# Altium schematic sheet stm32h755xih3.SchDoc
size 594 x 420 mm
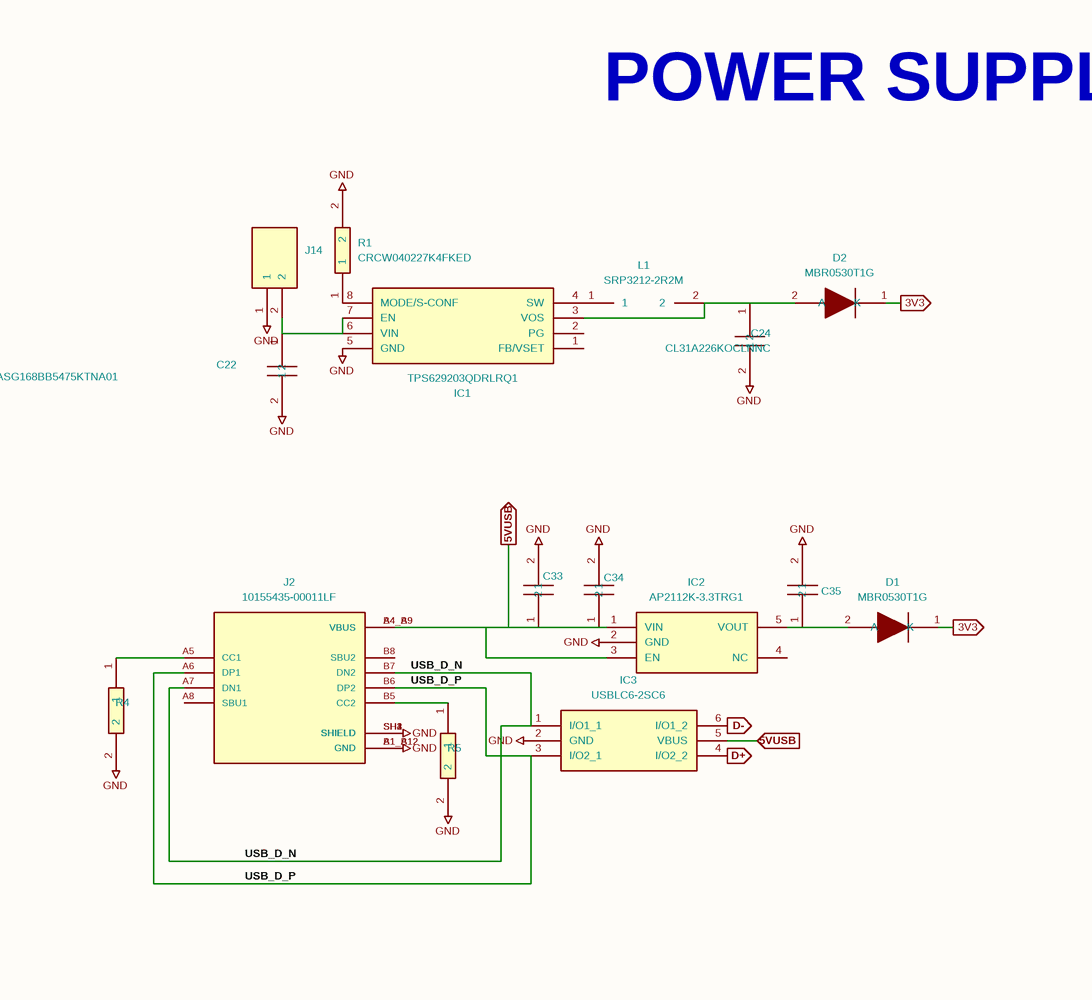
[diagram p0: stm32h755xih3.SchDoc, top left]
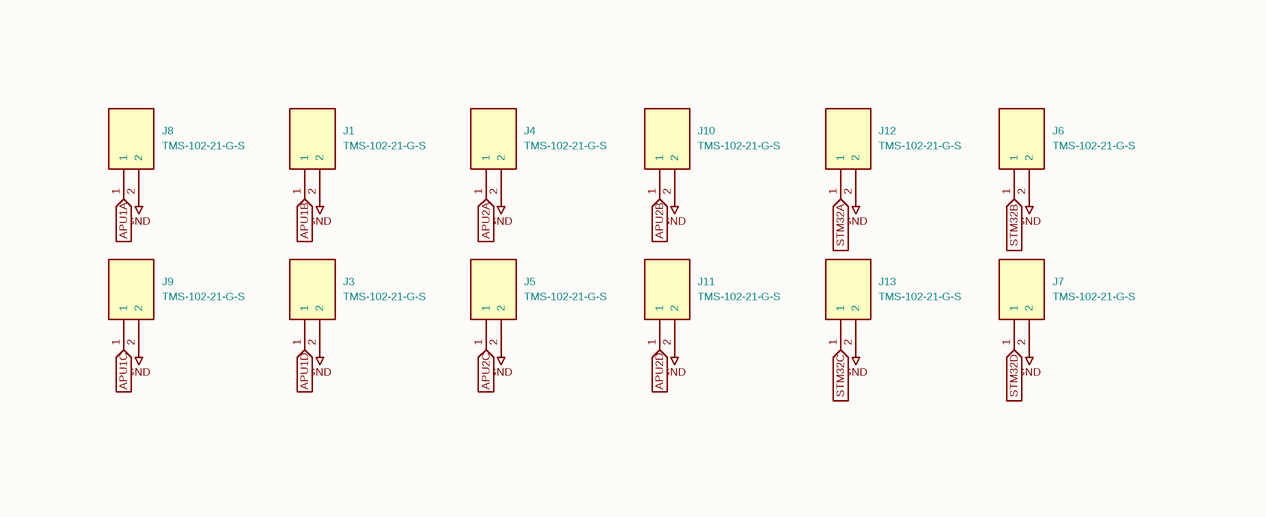
[diagram p1: stm32h755xih3.SchDoc, top right]
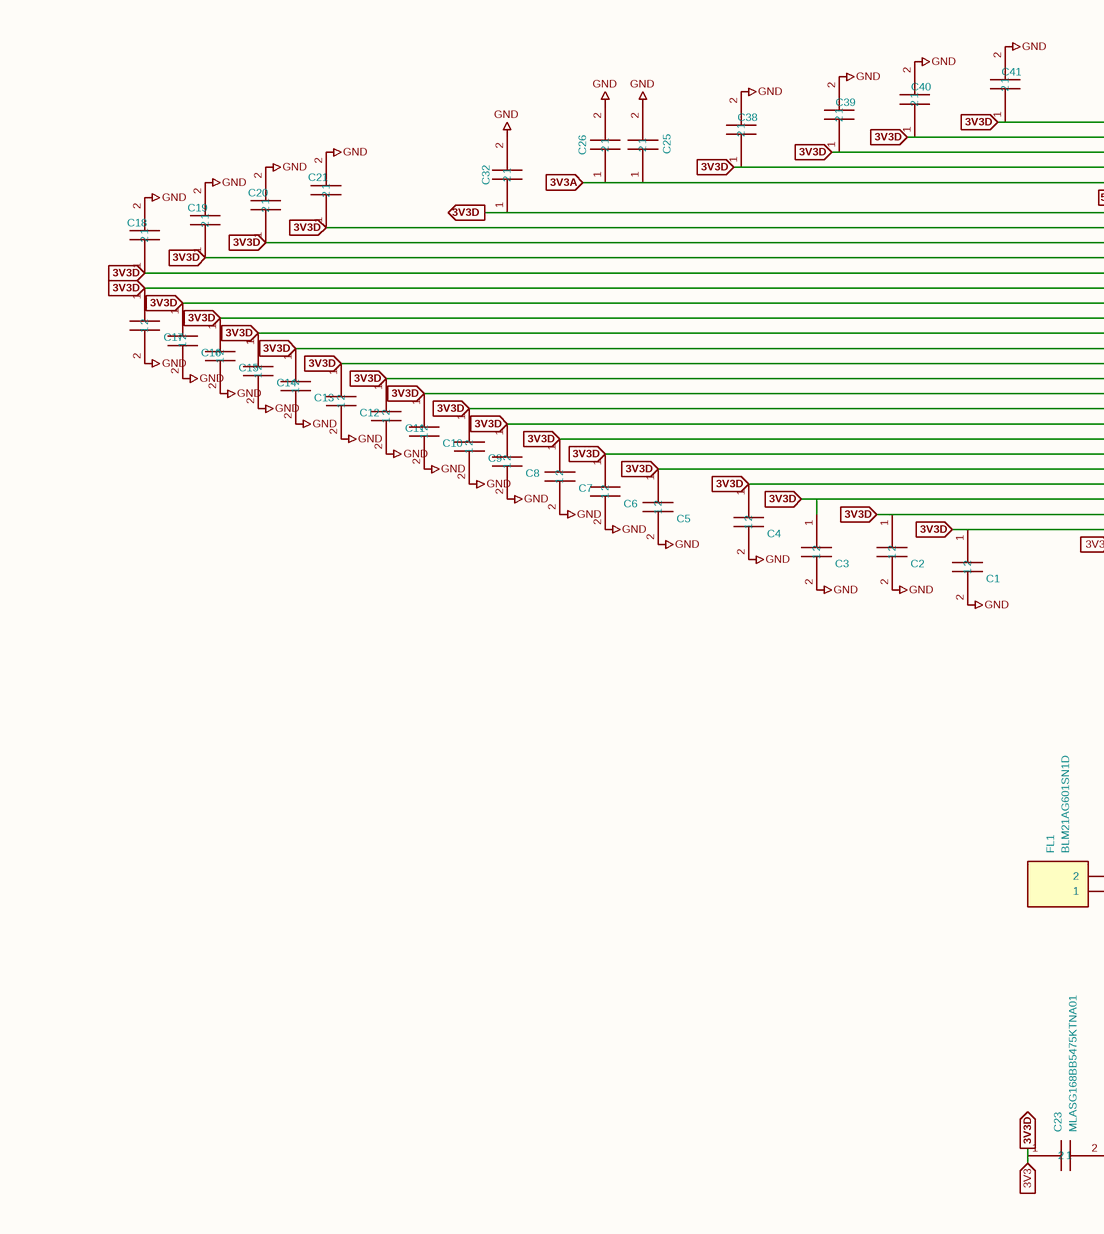
[diagram p2: stm32h755xih3.SchDoc, bottom left]
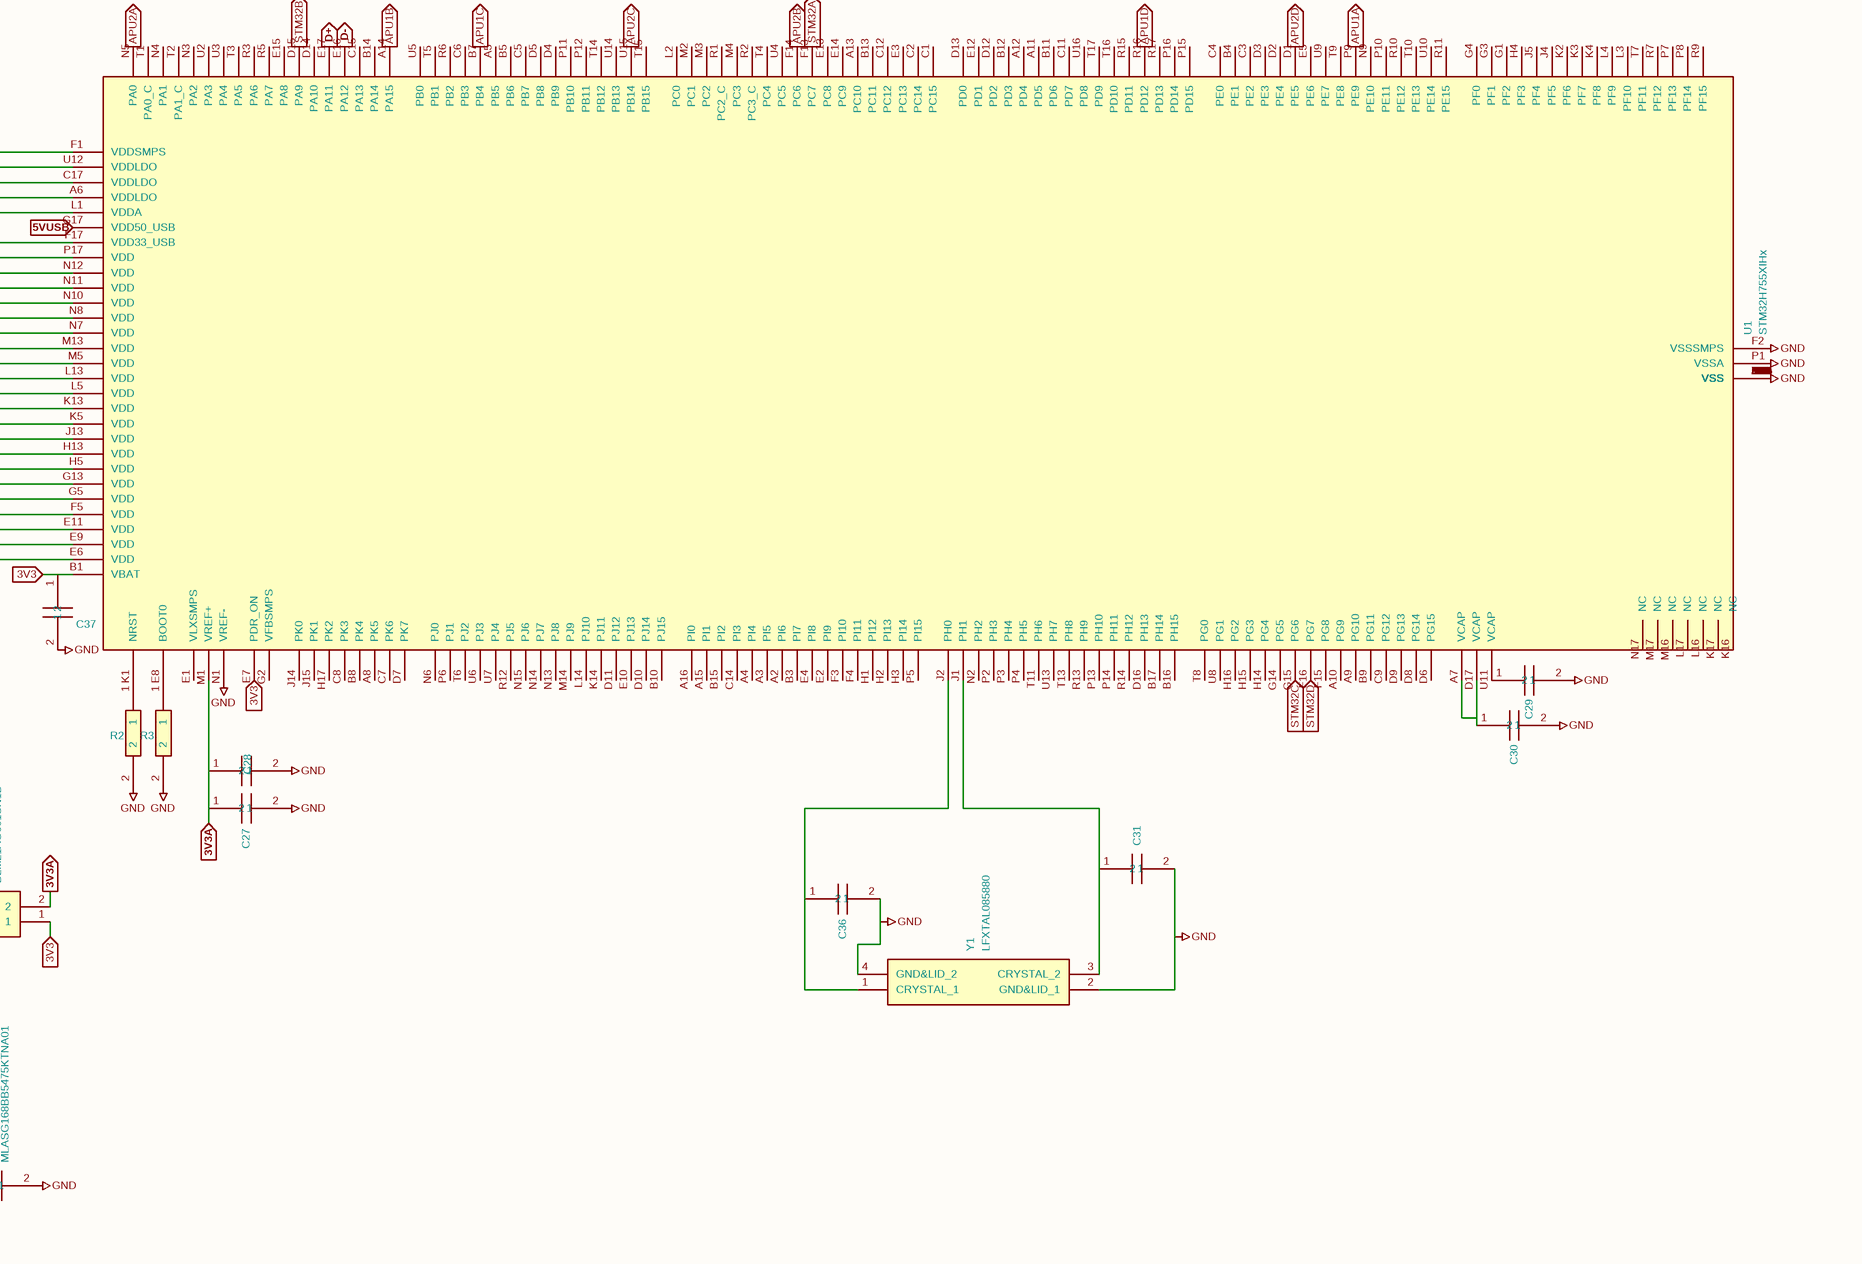
[diagram p3: stm32h755xih3.SchDoc, bottom right]

## Parts
C1  CC0603JRX7R9BB104  [CAPC1608X90N]  (value not drawn)
C2  CC0603JRX7R9BB104  [CAPC1608X90N]  (value not drawn)
C3  CC0603JRX7R9BB104  [CAPC1608X90N]  (value not drawn)
C4  CC0603JRX7R9BB104  [CAPC1608X90N]  (value not drawn)
C5  CC0603JRX7R9BB104  [CAPC1608X90N]  (value not drawn)
C6  CC0603JRX7R9BB104  [CAPC1608X90N]  (value not drawn)
C7  CC0603JRX7R9BB104  [CAPC1608X90N]  (value not drawn)
C8  CC0603JRX7R9BB104  [CAPC1608X90N]  (value not drawn)
C9  CC0603JRX7R9BB104  [CAPC1608X90N]  (value not drawn)
C10  CC0603JRX7R9BB104  [CAPC1608X90N]  (value not drawn)
C11  CC0603JRX7R9BB104  [CAPC1608X90N]  (value not drawn)
C12  CC0603JRX7R9BB104  [CAPC1608X90N]  (value not drawn)
C13  CC0603JRX7R9BB104  [CAPC1608X90N]  (value not drawn)
C14  CC0603JRX7R9BB104  [CAPC1608X90N]  (value not drawn)
C15  CC0603JRX7R9BB104  [CAPC1608X90N]  (value not drawn)
C16  CC0603JRX7R9BB104  [CAPC1608X90N]  (value not drawn)
C17  CC0603JRX7R9BB104  [CAPC1608X90N]  (value not drawn)
C18  CC0603JRX7R9BB104  [CAPC1608X90N]  (value not drawn)
C19  CC0603JRX7R9BB104  [CAPC1608X90N]  (value not drawn)
C20  CC0603JRX7R9BB104  [CAPC1608X90N]  (value not drawn)
C21  CC0603JRX7R9BB104  [CAPC1608X90N]  (value not drawn)
C22  MLASG168BB5475KTNA01  [CAPC1709X100N]
C23  MLASG168BB5475KTNA01  [CAPC1709X100N]
C24  CL31A226KOCLNNC  [CAPC3216X95N]
C25  CC0603JRX7R9BB104  [CAPC1608X90N]  (value not drawn)
C26  KGM31HR71C105JU  [CAPC3216X190N]  (value not drawn)
C27  KGM31HR71C105JU  [CAPC3216X190N]  (value not drawn)
C28  CC0603JRX7R9BB104  [CAPC1608X90N]  (value not drawn)
C29  12065C225JAT2A  [CAPC3216X229N]  (value not drawn)
C30  12065C225JAT2A  [CAPC3216X229N]  (value not drawn)
C31  06035C3R9CAT2A  [CAPC1608X90N]  (value not drawn)
C32  KGM31HR71C105JU  [CAPC3216X190N]  (value not drawn)
C33  MLASG168BB5475KTNA01  [CAPC1709X100N]  (value not drawn)
C34  KGM31HR71C105JU  [CAPC3216X190N]  (value not drawn)
C35  KGM31HR71C105JU  [CAPC3216X190N]  (value not drawn)
C36  06035C3R9CAT2A  [CAPC1608X90N]  (value not drawn)
C37  CC0603JRX7R9BB104  [CAPC1608X90N]  (value not drawn)
C38  CC0603JRX7R9BB104  [CAPC1608X90N]  (value not drawn)
C39  CC0603JRX7R9BB104  [CAPC1608X90N]  (value not drawn)
C40  CC0603JRX7R9BB104  [CAPC1608X90N]  (value not drawn)
C41  CC0603JRX7R9BB104  [CAPC1608X90N]  (value not drawn)
D1  MBR0530T1G  [SOD3716X135N]
D2  MBR0530T1G  [SOD3716X135N]
FL1  BLM21AG601SN1D  [BLM21AG102BH1J]
IC1  TPS629203QDRLRQ1  [SOTFL50P160X60-8N]
IC2  AP2112K-3.3TRG1  [SOT95P285X140-5N]
IC3  USBLC6-2SC6  [SOT95P280X145-6N]
J1  TMS-102-21-G-S  [TMS-102-YY-XX-S]
J2  10155435-00011LF  [AMPHENOL_10155435-00011LF]
J3  TMS-102-21-G-S  [TMS-102-YY-XX-S]
J4  TMS-102-21-G-S  [TMS-102-YY-XX-S]
J5  TMS-102-21-G-S  [TMS-102-YY-XX-S]
J6  TMS-102-21-G-S  [TMS-102-YY-XX-S]
J7  TMS-102-21-G-S  [TMS-102-YY-XX-S]
J8  TMS-102-21-G-S  [TMS-102-YY-XX-S]
J9  TMS-102-21-G-S  [TMS-102-YY-XX-S]
J10  TMS-102-21-G-S  [TMS-102-YY-XX-S]
J11  TMS-102-21-G-S  [TMS-102-YY-XX-S]
J12  TMS-102-21-G-S  [TMS-102-YY-XX-S]
J13  TMS-102-21-G-S  [TMS-102-YY-XX-S]
J14  TMS-102-21-G-S  [TMS-102-YY-XX-S]  (value not drawn)
L1  SRP3212-2R2M  [INDC2520X100N]
R1  CRCW040227K4FKED  [CRCW0402200KFKED]
R2  RC0402FR-0710KL  [RESC1005X40N]  (value not drawn)
R3  RC0402FR-0710KL  [RESC1005X40N]  (value not drawn)
R4  CRCW01005K10FREL  [RESC0402X15N]  (value not drawn)
R5  CRCW01005K10FREL  [RESC0402X15N]  (value not drawn)
U1  STM32H755XIHx  [TFBGA-265_14x14mm_Layout17x17_P0.8mm]
Y1  LFXTAL085880  [LFXTAL085880]

## Ports
3V3 (in), 3V3 (out), 3V3A (in), 3V3A (out), 3V3D (in), 3V3D (out), 5VUSB (in), 5VUSB (out), APU1A (in), APU1A (out), APU1B (in), APU1B (out), APU1C (in), APU1C (out), APU1D (in), APU1D (out), APU2A (in), APU2A (out), APU2B (in), APU2B (out), APU2C (in), APU2C (out), APU2D (in), APU2D (out), D+ (out), D- (out), STM32A (in), STM32A (out), STM32B (in), STM32B (out), STM32C (in), STM32C (out), STM32D (in), STM32D (out)

## Nets
GND: C1.2 C2.2 C3.2 C4.2 C5.2 C6.2 C7.2 C8.2 C9.2 C10.2 C11.2 C12.2 C13.2 C14.2 C15.2 C16.2 C17.2 C18.2 C19.2 C20.2 C21.2 C22.2 C23.2 C24.2 C25.2 C26.2 C27.2 C28.2 C29.2 C30.2 C31.2 C32.2 C33.2 C34.2 C35.2 C36.2 C37.2 C38.2 C39.2 C40.2 C41.2 IC1.5(GND) IC2.2(GND) IC3.2(GND) J1.2 J2.A1_B12(GND) J2.B1_A12(GND) J2.SH1(SHIELD) J2.SH2(SHIELD) J2.SH3(SHIELD) J2.SH4(SHIELD) J3.2 J4.2 J5.2 J6.2 J7.2 J8.2 J9.2 J10.2 J11.2 J12.2 J13.2 J14.1 R1.2 R2.2 R3.2 R4.2 R5.2 U1.A1(VSS) U1.A17(VSS) U1.B2(VSS) U1.B6(VSS) U1.C10(VSS) U1.C13(VSS) U1.C16(VSS) U1.F2(VSSSMPS) U1.G7(VSS) U1.G8(VSS) U1.G9(VSS) U1.G10(VSS) U1.G11(VSS) U1.G16(VSS) U1.H7(VSS) U1.H8(VSS) U1.H9(VSS) U1.H10(VSS) U1.H11(VSS) U1.J3(VSS) U1.J7(VSS) U1.J8(VSS) U1.J9(VSS) U1.J10(VSS) U1.J11(VSS) U1.J16(VSS) U1.J17(VSS) U1.K7(VSS) U1.K8(VSS) U1.K9(VSS) U1.K10(VSS) U1.K11(VSS) U1.K15(VSS) U1.L7(VSS) U1.L8(VSS) U1.L9(VSS) U1.L10(VSS) U1.L11(VSS) U1.L15(VSS) U1.M15(VSS) U1.N1(VREF-) U1.N16(VSS) U1.P1(VSSA) U1.R4(VSS) U1.R8(VSS) U1.T12(VSS) U1.U1(VSS) U1.U17(VSS) Y1.2(GND&LID_1) Y1.4(GND&LID_2)
3V3: C1.1 C2.1 C3.1 C4.1 C5.1 C6.1 C7.1 C8.1 C9.1 C10.1 C11.1 C12.1 C13.1 C14.1 C15.1 C16.1 C17.1 C18.1 C19.1 C20.1 C21.1 C23.1 C32.1 C37.1 C38.1 C39.1 C40.1 C41.1 D1.1(K) D2.1(K) FL1.1 U1.A6(VDDLDO) U1.B1(VBAT) U1.C17(VDDLDO) U1.E6(VDD) U1.E7(PDR_ON) U1.E9(VDD) U1.E11(VDD) U1.F1(VDDSMPS) U1.F5(VDD) U1.F17(VDD33_USB) U1.G5(VDD) U1.G13(VDD) U1.H5(VDD) U1.H13(VDD) U1.J13(VDD) U1.K5(VDD) U1.K13(VDD) U1.L5(VDD) U1.L13(VDD) U1.M5(VDD) U1.M13(VDD) U1.N7(VDD) U1.N8(VDD) U1.N10(VDD) U1.N11(VDD) U1.N12(VDD) U1.P17(VDD) U1.U12(VDDLDO) ; port 3V3, port 3V3D
3V3A: C25.1 C26.1 C27.1 C28.1 FL1.2 U1.L1(VDDA) U1.M1(VREF+) ; port 3V3A
5VUSB: C33.1 C34.1 IC2.1(VIN) IC2.3(EN) IC3.5(VBUS) J2.A4_B9(VBUS) J2.B4_A9(VBUS) U1.G17(VDD50_USB) ; port 5VUSB
APU1A: J8.1 U1.P9(PE9) ; port APU1A
APU1B: J1.1 U1.A14(PA15) ; port APU1B
APU1C: J9.1 U1.B7(PB4) ; port APU1C
APU1D: J3.1 U1.R16(PD12) ; port APU1D
APU2A: J4.1 U1.N5(PA0) ; port APU2A
APU2B: J10.1 U1.F14(PC6) ; port APU2B
APU2C: J5.1 U1.U15(PB14) ; port APU2C
APU2D: J11.1 U1.D1(PE5) ; port APU2D
D+: IC3.4(I/O2_2) U1.E17(PA11) ; port D+
D-: IC3.6(I/O1_2) U1.E16(PA12) ; port D-
STM32A: J12.1 U1.F13(PC7) ; port STM32A
STM32B: J6.1 U1.D15(PA9) ; port STM32B
STM32C: J13.1 U1.G15(PG6) ; port STM32C
STM32D: J7.1 U1.F16(PG7) ; port STM32D
USB_D_N: IC3.1(I/O1_1) J2.A7(DN1) J2.B7(DN2)
USB_D_P: IC3.3(I/O2_1) J2.A6(DP1) J2.B6(DP2)
NetC22_1: C22.1 IC1.6(VIN) IC1.7(EN) J14.2
NetC24_1: C24.1 D2.2(A) IC1.3(VOS) L1.2
NetC29_1: C29.1 U1.U11(VCAP)
NetC30_1: C30.1 U1.A7(VCAP) U1.D17(VCAP)
NetC31_1: C31.1 U1.J1(PH1) Y1.3(CRYSTAL_2)
NetC35_1: C35.1 D1.2(A) IC2.5(VOUT)
NetC36_1: C36.1 U1.J2(PH0) Y1.1(CRYSTAL_1)
NetIC1_4: IC1.4(SW) L1.1
NetIC1_8: IC1.8(MODE/S-CONF) R1.1
NetJ2_A5: J2.A5(CC1) R4.1
NetJ2_B5: J2.B5(CC2) R5.1
NetR2_1: R2.1 U1.K1(NRST)
NetR3_1: R3.1 U1.E8(BOOT0)

Not connected (* = marked no-connect by the designer): IC1 1(FB/VSET) 2(PG); IC2 4(NC); J2 A8(SBU1) B8(SBU2); U1 A2(PI6) A3(PI5) A4(PI4) A5(PB5) A8(PK5) A9(PG10) A10(PG9) A11(PD5) A12(PD4) A13(PC10) A15(PI1) A16(PI0) B3(PI7) B4(PE1) B5(PB6) B8(PK4) B9(PG11) B10(PJ15) B11(PD6) B12(PD3) B13(PC11) B14(PA14) B15(PI2) B16(PH15) B17(PH14) C1(PC15) C2(PC14) C3(PE2) C4(PE0) C5(PB7) C6(PB3) C7(PK6) C8(PK3) C9(PG12) C11(PD7) C12(PC12) C14(PI3) C15(PA13) D2(PE4) D3(PE3) D4(PB9) D5(PB8) D6(PG15) D7(PK7) D8(PG14) D9(PG13) D10(PJ14) D11(PJ12) D12(PD2) D13(PD0) D14(PA10) D16(PH13) E1(VLXSMPS) E2(PI9) E3(PC13) E4(PI8) E5(PE6) E10(PJ13) E12(PD1) E13(PC8) E14(PC9) E15(PA8) F3(PI10) F4(PI11) F15(PG8) G1(PF2) G2(VFBSMPS) G3(PF1) G4(PF0) G14(PG5) H1(PI12) H2(PI13) H3(PI14) H4(PF3) H14(PG4) H15(PG3) H16(PG2) H17(PK2) J4(PF5) J5(PF4) J14(PK0) J15(PK1) K2(PF6) K3(PF7) K4(PF8) K14(PJ11) K16(NC) K17(NC) L2(PC0) L3(PF10) L4(PF9) L14(PJ10) L16(NC) L17(NC) M2(PC1) M3(PC2) M4(PC3) M14(PJ9) M16(NC) M17(NC) N2(PH2) N3(PA2) N4(PA1) N6(PJ0) N9(PE10) N13(PJ8) N14(PJ7) N15(PJ6) N17(NC) P2(PH3) P3(PH4) P4(PH5) P5(PI15) P6(PJ1) P7(PF13) P8(PF14) P10(PE11) P11(PB10) P12(PB11) P13(PH10) P14(PH11) P15(PD15) P16(PD14) R1(PC2_C) R2(PC3_C) R3(PA6) R5(PA7) R6(PB2) R7(PF12) R9(PF15) R10(PE12) R11(PE15) R12(PJ5) R13(PH9) R14(PH12) R15(PD11) R17(PD13) T1(PA0_C) T2(PA1_C) T3(PA5) T4(PC4) T5(PB1) T6(PJ2) T7(PF11) T8(PG0) T9(PE8) T10(PE13) T11(PH6) T13(PH8) T14(PB12) T15(PB15) T16(PD10) T17(PD9) U2(PA3) U3(PA4) U4(PC5) U5(PB0) U6(PJ3) U7(PJ4) U8(PG1) U9(PE7) U10(PE14) U13(PH7) U14(PB13) U16(PD8)

## Notes on the sheet
- POWER SUPPLY
- 1
- 2
- 3
- 4
- 5
- 6
- 7
- 8
- 9
- 10
- 11
- A
- B
- C
- D
- E
- F
- G
- H
- Title:
- File: stm32h755xih3.kicad_sch
- Sheet: /
- KiCad E.D.A.  kicad (5.1.4)-1
- Size: A2
- Date:
- Rev:
- Id: 1/1

## Library data of the parts
C1-C21 C25 C28 C37-C41 = CC0603JRX7R9BB104: Manufacturer_Name: YAGEO; Description: Multilayer Ceramic Capacitors MLCC - SMD/SMT 50 V 0.1uF X7R 0603 5%; Height: 0.9; Mouser Part Number: 603-CC603JRX7R9BB104; Mouser Price/Stock: https://www.mouser.co.uk/ProductDetail/YAGEO/CC0603JRX7R9BB104?qs=57cj7OiSijmjSM%252BQadQODQ%3D%3D; Manufacturer_Part_Number: CC0603JRX7R9BB104; Value: CC0603JRX7R9BB104
C22 C33 = MLASG168BB5475KTNA01_1: Manufacturer_Name: TAIYO YUDEN; Description: 4.7 F +/-10% 35V Ceramic Capacitor X5R 0603 (1608 Metric); Height: 1; Mouser Part Number: 963-MLASG168BB5475KT; Mouser Price/Stock: https://www.mouser.co.uk/ProductDetail/TAIYO-YUDEN/MLASG168BB5475KTNA01?qs=tlsG%2FOw5FFhCGJXg7RRAyQ%3D%3D; Manufacturer_Part_Number: MLASG168BB5475KTNA01; Value: MLASG168BB5475KTNA01
C23 = MLASG168BB5475KTNA01: Manufacturer_Name: TAIYO YUDEN; Description: 4.7 F +/-10% 35V Ceramic Capacitor X5R 0603 (1608 Metric); Height: 1; Mouser Part Number: 963-MLASG168BB5475KT; Mouser Price/Stock: https://www.mouser.co.uk/ProductDetail/TAIYO-YUDEN/MLASG168BB5475KTNA01?qs=tlsG%2FOw5FFhCGJXg7RRAyQ%3D%3D; Manufacturer_Part_Number: MLASG168BB5475KTNA01; Value: MLASG168BB5475KTNA01
C24 = CL31A226KOCLNNC: Manufacturer_Name: SAMSUNG; Description: Samsung Electro-Mechanics 1206 CL 22uF Ceramic Multilayer Capacitor, 16 V, +85C, X5R Dielectric, +/-10% SMD; Height: 0.95; Mouser Part Number: 187-CL31A226KOCLNNC; Mouser Price/Stock: https://www.mouser.co.uk/ProductDetail/Samsung-Electro-Mechanics/CL31A226KOCLNNC?qs=X6jEic%2FHinC3Oh0BQrI53w%3D%3D; Manufacturer_Part_Number: CL31A226KOCLNNC; Value: CL31A226KOCLNNC
C26 C27 C32 C34 C35 = KGM31HR71C105JU: Manufacturer_Name: Kyocera AVX; Description: Multilayer Ceramic Capacitors MLCC - SMD/SMT 16V 1uF X7R 1206 5%; Height: 1.9; Mouser Part Number: 581-KGM31HR71C105JU; Mouser Price/Stock: https://www.mouser.co.uk/ProductDetail/KYOCERA-AVX/KGM31HR71C105JU?qs=Jm2GQyTW%2FbiIcGE031ASbA%3D%3D; Manufacturer_Part_Number: KGM31HR71C105JU; Value: KGM31HR71C105JU
C29 C30 = 12065C225JAT2A: Manufacturer_Name: Kyocera AVX; Description: Multilayer Ceramic Capacitors MLCC - SMD/SMT 2.2UF 50V 5% 1206; Height: 2.29; Mouser Part Number: 581-12065C225JAT2A; Mouser Price/Stock: https://www.mouser.co.uk/ProductDetail/KYOCERA-AVX/12065C225JAT2A?qs=T3oQrply3y8mt4oSQI9cEw%3D%3D; Manufacturer_Part_Number: 12065C225JAT2A; Value: 12065C225JAT2A
C31 C36 = 06035C3R9CAT2A: Manufacturer_Name: Kyocera AVX; Description: Multilayer Ceramic Capacitors MLCC - SMD/SMT T101 COMMERCIAL; Height: 0.9; Mouser Part Number: 581-06035C3R9CAT2A; Mouser Price/Stock: https://www.mouser.co.uk/ProductDetail/AVX/06035C3R9CAT2A?qs=k4kUdCzLgS4to0WEc2epxQ%3D%3D; Manufacturer_Part_Number: 06035C3R9CAT2A; Value: 06035C3R9CAT2A
D1 D2 = MBR0530T1G: Manufacturer_Name: onsemi; Description: Guardring for Stress Protection; Low Forward Voltage; 125 C Operating Junction Temperature; Epoxy Meets UL94, VO at 1/8"; Package Designed for Optimal Automated Board Assembly Mechanical Characteristics:; Reel Options: MBR0530T1 = 3,000 per 7" reel/8 mm tape MBR0530T3 = 10,000 per 13" reel/8 mm tape; Device Marking: B3; Polarity Designator: Cathode Band; Weight: 11.7 mg (approximately); Case: Epoxy, Molded; Finish: All External Surfaces Corrosion Resistant and Terminal Leads are Readily Solderable; Lead and; Height: 1.35; Mouser Part Number: 863-MBR0530T1G; Mouser Price/Stock: https://www.mouser.co.uk/ProductDetail/onsemi/MBR0530T1G?qs=3JMERSakeboS%2FFOxJUMWeg%3D%3D; Manufacturer_Part_Number: MBR0530T1G; Value: MBR0530T1G
FL1 = BLM21AG601SN1D: Manufacturer_Name: Murata Electronics; Description: BLM21_N1D Series EMI Suppression Filter 600+/-25% at 100MHz 700mA @85; Height: 1.05; Mouser Part Number: 81-BLM21A601F; Mouser Price/Stock: https://www.mouser.co.uk/ProductDetail/Murata-Electronics/BLM21AG601SN1D?qs=eh6oC%2F9l24pbrhIl76%2FqAA%3D%3D; Manufacturer_Part_Number: BLM21AG601SN1D; Value: BLM21AG601SN1D
IC1 = TPS629203QDRLRQ1: Manufacturer_Name: Texas Instruments; Description: Switching Voltage Regulators Automotive 3-V to 17-V, 0.3-A, low-IQ, synchronous buck converter in SOT-583 package; Height: 0.6; Mouser Part Number: 595-TPS629203QDRLRQ1; Mouser Price/Stock: https://www.mouser.co.uk/ProductDetail/Texas-Instruments/TPS629203QDRLRQ1?qs=t7xnP681wgXRtyDG5rrDnQ%3D%3D; Manufacturer_Part_Number: TPS629203QDRLRQ1; Value: TPS629203QDRLRQ1
IC2 = AP2112K-3.3TRG1: Manufacturer_Name: Diodes Incorporated; Description: 600mA 3.3V LDO Regulator Enable SOT23-5 DiodesZetex AP2112K-3.3TRG1, LDO Voltage Regulator, 3.3 V +/-1.5%, 2.5  6 Vin, 5-Pin SOT-23; Height: 1.4; Mouser Part Number: 621-AP2112K-3.3TRG1; Mouser Price/Stock: https://www.mouser.co.uk/ProductDetail/Diodes-Incorporated/AP2112K-3.3TRG1?qs=x6A8l6qLYDDPYHosCdzh%2FA%3D%3D; Manufacturer_Part_Number: AP2112K-3.3TRG1; Value: AP2112K-3.3TRG1
IC3 = USBLC6-2SC6: Manufacturer_Name: STMicroelectronics; Description: TVS Diode Array Uni-Directional USBLC6-2SC6 17V, SOT-23 6-Pin; Height: 1.45; Mouser Part Number: 511-USBLC6-2SC6; Mouser Price/Stock: https://www.mouser.co.uk/ProductDetail/STMicroelectronics/USBLC6-2SC6?qs=po45yt2pPpu%2FhNIlwQdTlg%3D%3D; Manufacturer_Part_Number: USBLC6-2SC6; Value: USBLC6-2SC6
J1 J3-J14 = TMS-102-21-G-S: Manufacturer_Name: SAMTEC; Description: 2 Position, Single-Row .050&quot; x .100&quot; Micro Terminal Strip; Mouser Part Number: 200-TMS10221GS; Mouser Price/Stock: https://www.mouser.co.uk/ProductDetail/Samtec/TMS-102-21-G-S?qs=0lQeLiL1qya3I3g9lQbxtA%3D%3D; Manufacturer_Part_Number: TMS-102-21-G-S; Value: TMS-102-21-G-S
J2 = 10155435-00011LF: MANUFACTURER: Amphenol; MF: Amphenol FCI; Description_1: USB Type C Receptacle SMT Single Row 16Pin; DigiKey_Part_Number: 609-10155435-00011LFCT-ND; SnapEDA_Link: https://www.snapeda.com/parts/10155435-00011LF/Amphenol/view-part/?ref=snap; MAXIMUM_PACKAGE_HEIGHT: 3.37 mm; Package: None; Check_prices: https://www.snapeda.com/parts/10155435-00011LF/Amphenol/view-part/?ref=eda; STANDARD: Manufacturer Recommendations; PARTREV: C; MP: 10155435-00011LF; Value: 10155435-00011LF; Footprint: 10155435-00011LF:AMPHENOL_10155435-00011LF
L1 = SRP3212-2R2M: Manufacturer_Name: Bourns; Description: Ind,3.2x2.5x1mm,2.2uH?20%,4A,shd; Height: 1; Mouser Part Number: 652-SRP3212-2R2M; Mouser Price/Stock: https://www.mouser.co.uk/ProductDetail/Bourns/SRP3212-2R2M?qs=t7xnP681wgW9NT%2FfJNx1CA%3D%3D; Manufacturer_Part_Number: SRP3212-2R2M; Value: SRP3212-2R2M
R1 = CRCW040227K4FKED: Manufacturer_Name: Vishay; Description: Vishay CRCW Series Thick Film Surface Mount Resistor 0402 Case 27.4k +/-1% 0.063W +/-100ppm/C; Height: 0.4; Mouser Part Number: 71-CRCW0402-27.4K-E3; Mouser Price/Stock: https://www.mouser.co.uk/ProductDetail/Vishay-Dale/CRCW040227K4FKED?qs=hD42E%2F8yzjo1p2852u38Sw%3D%3D; Manufacturer_Part_Number: CRCW040227K4FKED; Value: CRCW040227K4FKED
R2 R3 = RC0402FR-0710KL: Manufacturer_Name: YAGEO; Description: YAGEO (PHYCOMP) - RC0402FR-0710KL. - RES, THICK FILM, 10K, 1%, 0.0625W, 0402; Height: 0.4; Mouser Part Number: 603-RC0402FR-0710KL; Mouser Price/Stock: https://www.mouser.co.uk/ProductDetail/YAGEO/RC0402FR-0710KL?qs=I1mnnYJTTsxUoNwrUsQExA%3D%3D; Manufacturer_Part_Number: RC0402FR-0710KL; Value: RC0402FR-0710KL
R4 R5 = CRCW01005K10FREL: Manufacturer_Name: Vishay; Description: Thick Film Resistors - SMD 01005 5.1Kohm 1% 250ppm 0.031watts; Height: 0.15; Mouser Part Number: 71-CRCW01005K10FREL; Mouser Price/Stock: https://www.mouser.co.uk/ProductDetail/Vishay-Dale/CRCW01005K10FREL?qs=1mbolxNpo8dej5SLtoRDjQ%3D%3D; Manufacturer_Part_Number: CRCW01005K10FREL; Value: CRCW01005K10FREL
U1 = STM32H755XIHx: Description: STMicroelectronics Arm Cortex-M7 MCU, 2048KB flash, 1024KB RAM, 480 MHz, 1.62-3.6V, 172 GPIO, TFBGA240; Value: STM32H755XIHx; Footprint: Package_BGA:TFBGA-265_14x14mm_Layout17x17_P0.8mm
Y1 = LFXTAL085880: Manufacturer_Name: IQD; Description: 25 MHz +/-20ppm Crystal 8pF 50 Ohms 4-SMD, No Lead; Height: 0.8; Manufacturer_Part_Number: LFXTAL085880; Value: LFXTAL085880